# Altium project digital_thermostat.PrjPCB
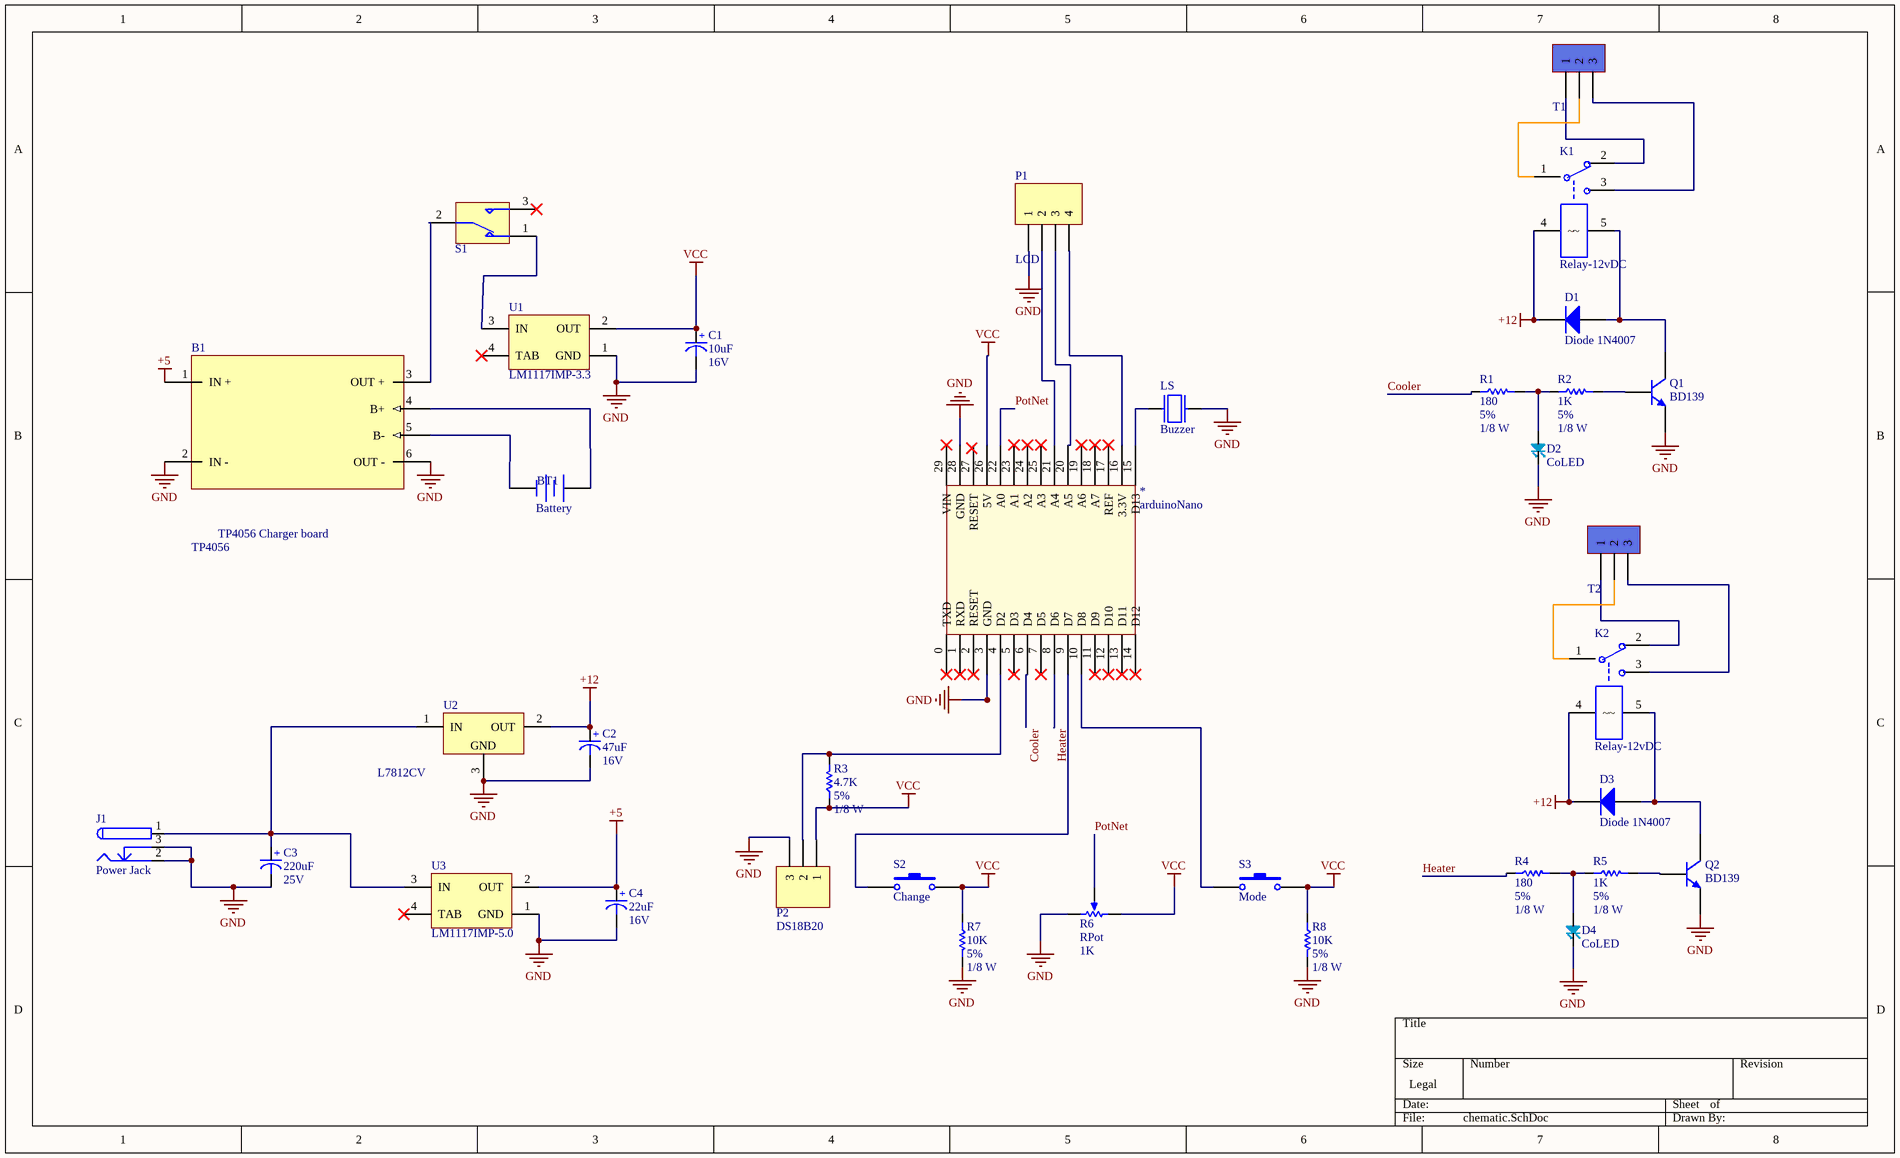
[diagram p0: chematic.SchDoc]
1 sheet, 35 parts. Net scope: global (net labels, ports and power ports of the same name join across sheets).
Board file: PCB1.PcbDoc

## Sheet chematic.SchDoc
size Legal

### Parts
ArduinoNano  arduinoNano  [Arduino nano]
B1  TP4056  [TP4056]
BT1  Battery  [BAT-2]
C1  Voltage: 16V  [cap 00]  (hidden comment: 10uf)
C2  Voltage: 16V  [cap 01]  (hidden comment: 47uf)
C3  Voltage: 25V  [cap 03]  (hidden comment: 220uf)
C4  Voltage: 16V  [cap 00]  (hidden comment: 22uf)
D1  Diode 1N4007  [DO-41]
D2  CoLED  [LED_5MM]
D3  Diode 1N4007  [DO-41]
D4  CoLED  [LED_5MM]
J1  Power Jack  [Power Jack]
K1  Relay-12vDC  [Relays]
K2  Relay-12vDC  [Relays]
LS  Buzzer  [XDCR_PS1240P02BT]
P1  LCD  [HDR1X4]
P2  DS18B20  [HDR1X3]
Q1  BD139  [SOT-32]
Q2  BD139  [SOT-32]
R1  value 180  Tolerance: 5%  Power: 1/8 W  [Res-(1/4)]  (hidden comment: 180R)
R2  Tolerance: 5%  Power: 1/8 W  [Res-(1/4)]  (hidden comment: 1K)
R3  Tolerance: 5%  Power: 1/8 W  [Res-(1/4)]  (hidden comment: 4.7K)
R4  value 180  Tolerance: 5%  Power: 1/8 W  [Res-(1/4)]  (hidden comment: 180R)
R5  Tolerance: 5%  Power: 1/8 W  [Res-(1/4)]  (hidden comment: 1K)
R6  RPot  value 1K  [VR5]
R7  Tolerance: 5%  Power: 1/8 W  [Res-(1/4)]  (hidden comment: 10K)
R8  Tolerance: 5%  Power: 1/8 W  [Res-(1/4)]  (hidden comment: 10K)
S1  Switch SPDT_Subminiator  [SPDT Subminiator]  (value not drawn)
S2  Change  [Switch - Push to On]
S3  Mode  [Switch - Push to On]
T1  Terminal  [Terminal 1*3]  (value not drawn)
T2  Terminal  [Terminal 1*3]  (value not drawn)
U1  LM1117IMP-3.3  [MP04A_N]
U2  L7812CV  [78XXCV - Right]
U3  LM1117IMP-5.0  [MP04A_N]

### Nets
+5: B1.1(IN_+) C4.1(+) U3.2(OUT)
+12: C2.1(+) D1.2(K) D3.2(K) K1.4 K2.4 U2.2(OUT)
GND: ArduinoNano.3(GND) ArduinoNano.28(GND) B1.2(IN_-) B1.6(OUT_-) C1.2(-) C2.2(-) C3.2(-) C4.2(-) D2.2 D4.2 J1.2 J1.3 LS.2 P1.1 P2.3 Q1.E Q2.E R6.2(BOT) R7.2 R8.2 U1.1(GND) U2.3(GND) U3.1(GND)
VCC: ArduinoNano.26(5V) C1.1(+) P2.1 R3.1 R6.1(TOP) R7.1 R8.1 S2.2 S3.2 U1.2(OUT)
Cooler: ArduinoNano.6(D4) R1.1
Heater: ArduinoNano.8(D6) R4.1
PotNet: ArduinoNano.22(A0) R6.3(TAP)
NetArduinoNano_4: ArduinoNano.4(D2) P2.2 R3.2
NetArduinoNano_9: ArduinoNano.9(D7) S2.1
NetArduinoNano_10: ArduinoNano.10(D8) S3.1
NetArduinoNano_15: ArduinoNano.15(D13) LS.1
NetArduinoNano_16: ArduinoNano.16(3.3V) P1.4
NetArduinoNano_20: ArduinoNano.20(A5) P1.3
NetArduinoNano_21: ArduinoNano.21(A4) P1.2
NetB1_3: B1.3(OUT_+) S1.2
NetB1_4: B1.4(B+) BT1.1(+)
NetB1_5: B1.5(B-) BT1.2(-)
NetC3_1: C3.1(+) J1.1 U2.1(IN) U3.3(IN)
NetD1_1: D1.1(A) K1.5 Q1.C
NetD2_1: D2.1 R1.2 R2.1
NetD3_1: D3.1(A) K2.5 Q2.C
NetD4_1: D4.1 R4.2 R5.1
NetK1_1: K1.1(COM) T1.2
NetK1_2: K1.2(NC) T1.1
NetK1_3: K1.3(NO) T1.3
NetK2_1: K2.1(COM) T2.2
NetK2_2: K2.2(NC) T2.1
NetK2_3: K2.3(NO) T2.3
NetQ1_B: Q1.B R2.2
NetQ2_B: Q2.B R5.2
NetS1_1: S1.1 U1.3(IN)

Not connected (* = marked no-connect by the designer): ArduinoNano 0(TXD)* 1(RXD)* 2(RESET)* 5(D3)* 7(D5)* 11(D9)* 12(D10)* 13(D11)* 14(D12)* 17(REF)* 18(A7)* 19(A6)* 23(A1)* 24(A2)* 25(A3)* 27(RESET) 29(VIN)*; S1 3*; U1 4(TAB)*; U3 4(TAB)*

### Notes on the sheet
- (in symbol TP4056) TP4056 Charger board

### Library data of the parts
B1 = TP4056: li ion charger board
BT1 = Battery: Multicell Battery; Published: 24-Mar-1999; LatestRevisionDate: 17-Jul-2002; LatestRevisionNote: Re-released for DXP Platform.; PackageReference: BAT-2; Publisher: Altium Limited; PackageDescription: Battery; 2 Leads
C1-C4 = Cap-Polar: Polar Capacitor; Designer: Saeid Jorablo; Organazation: ControTec; Adding Date: 1387/12/20
  C1: Value: 10uF
  C2: Value: 47uF
  C3: Value: 220uF
  C4: Value: 22uF
D1 D3 = Diode 1N4007: 1 Amp General Purpose Rectifier; Published: 8-Jun-2000; LatestRevisionDate: 17-Jul-2002; LatestRevisionNote: Re-released for DXP Platform.; DatasheetVersion: 1998; PackageVersion: Aug-1999; PackageReference: DO-41; Publisher: Altium Limited; PackageDescription: Diode, Axial; Body 5.2 x 2.7 mm (LxDia. max), Lead Dia. 0.86 mm (max); Code_JEDEC: DO-204-AL; ComponentLink1Description: Manufacturer Link; ComponentLink1URL: http://www.fairchildsemi.com/; ComponentLink2Description: Datasheet; ComponentLink2URL: http://www.fairchildsemi.com/ds/1N%2F1N4001.pdf
D2 D4 = LED: Blue LED for Cooler
J1 = Power Jack: Designer: Saeid Jorablo; Company: Personal; Project Name: Laser; Adding Date: 10/21/2009
K1 = Relay-05vDC: Cooler Relay; Designer: Seyed Mohsen Ghasemain; ComponentLinkURL: www.picpars.com
K2 = Relay-05vDC: Heater Relay; Designer: Seyed Mohsen Ghasemain; ComponentLinkURL: www.picpars.com
LS = PS1240P02BT: Buzzers Transducer, Externally Driven Piezo 3V 4kHz 60dB @ 3V, 10cm Through Hole PC Pins; MF: TDK; MP: PS1240P02BT; Availability: Unavailable; Package: 2020 TDK; Value: *; Price: None; SnapEDA_Link: https://www.snapeda.com/parts/PS1240P02BT/TDK/view-part/53420/?ref=snap
P1 = Header 4: I2C Oled; LatestRevisionDate: 17-Jul-2002; LatestRevisionNote: Re-released for DXP Platform.; Publisher: Altium Limited
P2 = Header 3: Header, 3-Pin; LatestRevisionDate: 17-Jul-2002; LatestRevisionNote: Re-released for DXP Platform.; Publisher: Altium Limited
Q1 Q2 = BD139: NPN Transistor; E-mail: picpars@gmail.com; De: Seyed Mohsen Ghasemian; web: www.picpars.com
R1-R5 R7 R8 = Resistor
  R2 R5: Value: 1K
  R3: Value: 4.7K
  R7 R8: Value: 10K
R6 = RPot: Potentiometer; Sim Note: Enter the Resistance value and the set point into parameter fields.; Set Position: 0.5; Published: 8-Jun-2000; LatestRevisionDate: 17-Jul-2002; LatestRevisionNote: Re-released for DXP Platform.; PackageReference: VR5; Publisher: Altium Limited; PackageDescription: Variable Resistor, Thru-Hole; 3 Leads
S1 = Switch SPDT_Subminiator: Subminiator SPDT Switch; Company: E.P.I.L; Design date: 2011/11/02
S2 S3 = Switch PB: Push Button Switch
T1 = Terminal 1*3: Cooler Terminal; Designer: Seyed Mohsen Ghasemain; E-mail: picpars@gmail.com; ComponentLinkURL: www.picpars.com
T2 = Terminal 1*3: Heater Terminal; Designer: Seyed Mohsen Ghasemain; E-mail: picpars@gmail.com; ComponentLinkURL: www.picpars.com
U1 = LM1117IMP-x.x: x.x Volt, 800mA Low-Dropout Linear Regulator, 4-pin SOT-223; Manufacturer: National Semiconductor; PackageTopMarking: XYTT*N05B; PowerWise: N; CompType: LDO IC; Published: 4-Dec-2008; DatasheetVersion: Apr-2006; PackageVersion: revB, Apr-2003; PackageReference: MP04A; Publisher: Altium Limited; PackageDescription: Molded SOT-223, 6.50 x 3.56 x 1.6mm Body, 4 Lead, 2.3mm Pitch; Supplier 1: Farnell; Supplier Part Number 1: 7614123; PartNumber: LM1117IMP-3.3; RoHS: N; PinCount: 4; Code_JEDEC: TO-261-AA; Code_IPC: SOT223-4; ComponentLink1Description: LM1117 Datasheet; ComponentLink1URL: http://www.national.com/ds/LM/LM1117.pdf; ComponentLink2Description: LM1117 Web Page; ComponentLink2URL: http://www.national.com/pf/LM/LM1117.html; ComponentLink3Description: MP04A Package Page; ComponentLink3URL: http://www.national.com/packaging/folders/mp04a.html
U2 = L78XXCV: Fixed Voltage Regulator; Designer: Saeid Jorablo; Company: ControTec; Voltage: 12; Adding Date: 1387/01/06
U3 = LM1117IMP-x.x: x.x Volt, 800mA Low-Dropout Linear Regulator, 4-pin SOT-223; PartNumber: LM1117IMP-3.3; Manufacturer: National Semiconductor; PackageTopMarking: XYTT*N05B; PowerWise: N; CompType: LDO IC; Published: 4-Dec-2008; DatasheetVersion: Apr-2006; PackageVersion: revB, Apr-2003; PackageReference: MP04A; Publisher: Altium Limited; PackageDescription: Molded SOT-223, 6.50 x 3.56 x 1.6mm Body, 4 Lead, 2.3mm Pitch; Supplier 1: Farnell; Supplier Part Number 1: 7614123; RoHS: N; PinCount: 4; Code_JEDEC: TO-261-AA; Code_IPC: SOT223-4; ComponentLink1Description: LM1117 Datasheet; ComponentLink1URL: http://www.national.com/ds/LM/LM1117.pdf; ComponentLink2Description: LM1117 Web Page; ComponentLink2URL: http://www.national.com/pf/LM/LM1117.html; ComponentLink3Description: MP04A Package Page; ComponentLink3URL: http://www.national.com/packaging/folders/mp04a.html